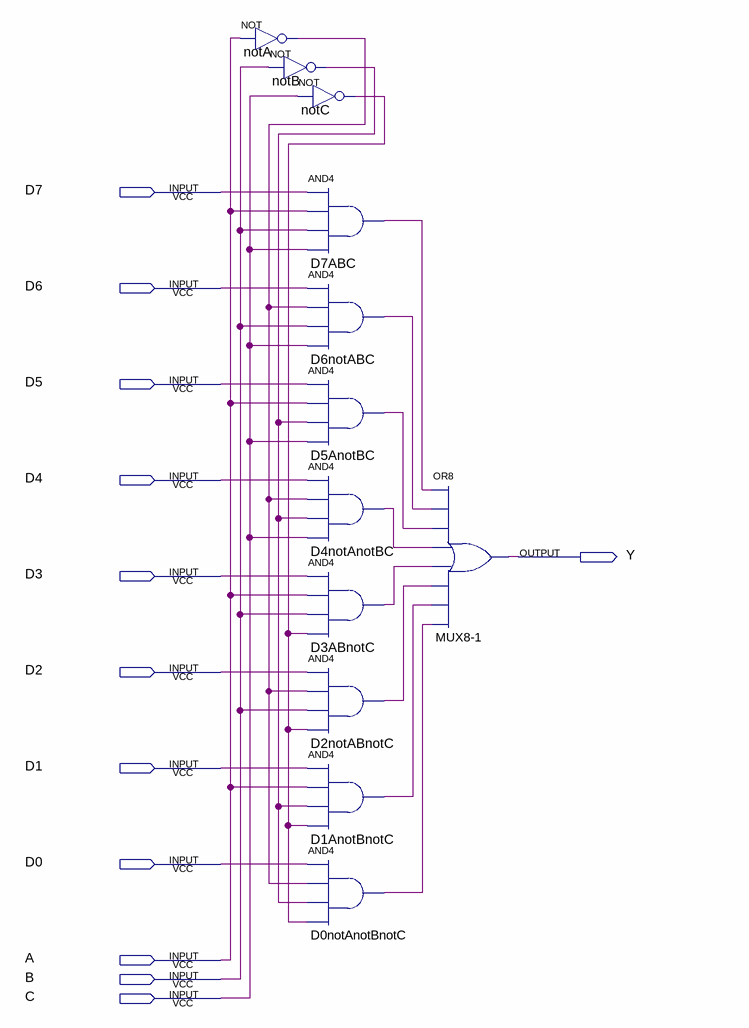
[diagram p0: schematic sheet]
// Quartus schematic Prac3.bdf as structural Verilog: 12 symbols, 12 pins
module Prac3 (
  input  D7,
  input  D6,
  input  D5,
  input  D4,
  input  D3,
  input  D2,
  input  D1,
  input  D0,
  input  A,
  input  B,
  input  C,
  output Y
);

  wire D0notAnotBnotC_out, D1AnotBnotC_out, D2notABnotC_out, D3ABnotC_out, D4notAnotBC_out, D5AnotBC_out,
       D6notABC_out, D7ABC_out, notA_out, notB_out, notC_out;

  not notA (notA_out, A);
  not notB (notB_out, B);
  not notC (notC_out, C);
  and D7ABC (D7ABC_out, D7, A, B, C);
  and D6notABC (D6notABC_out, D6, notA_out, B, C);
  and D5AnotBC (D5AnotBC_out, D5, A, notB_out, C);
  and D4notAnotBC (D4notAnotBC_out, D4, notA_out, notB_out, C);
  and D3ABnotC (D3ABnotC_out, D3, A, B, notC_out);
  and D2notABnotC (D2notABnotC_out, D2, notA_out, B, notC_out);
  and D1AnotBnotC (D1AnotBnotC_out, D1, A, notB_out, notC_out);
  and D0notAnotBnotC (D0notAnotBnotC_out, D0, notA_out, notB_out, notC_out);
  or \MUX8-1  (Y, D7ABC_out, D6notABC_out, D5AnotBC_out, D4notAnotBC_out, D3ABnotC_out, D2notABnotC_out, D1AnotBnotC_out, D0notAnotBnotC_out);
endmodule
